# EAGLE schematic load_cell_amp_JA (EAGLE 9.5.2)
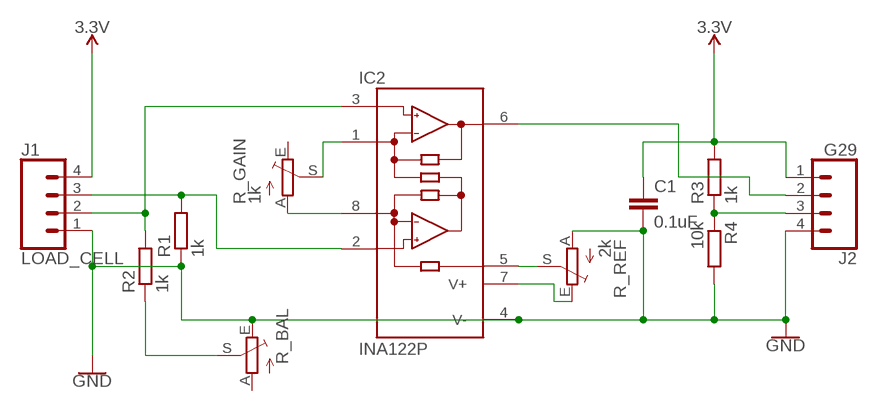
[diagram p0: schematic, sheet 1]

## Parts
C1  0.1uF  C-EU025-024X044  [C025-024X044]
IC2  INA122P  [DIL08]
J1  LOAD_CELL  M04  [04P]
J2  G29  M04  [04P]
R1  1k  R-EU_0207/10  [0207/10]
R2  1k  R-EU_0207/10  [0207/10]
R3  1k  R-EU_0207/10  [0207/10]
R4  10k  R-EU_0207/10  [0207/10]
R_BAL  10  TRIM_EU-RJ9W  [RJ9W]
R_GAIN  1k  TRIM_EU-RJ9W  [RJ9W]
R_REF  2k  TRIM_EU-RJ9W  [RJ9W]

## Nets
3.3V: C1.1 J1.4 J2.1 R3.2
GND: C1.2 IC2.4(V-) J1.1 J2.4 R1.1 R4.2 R_BAL.E R_REF.A
N$1: IC2.2(-IN) J1.3 R1.2
N$2: IC2.3(+IN) J1.2 R2.2
N$3: R2.1 R_BAL.S
N$4: IC2.1(RG) R_GAIN.S
N$5: IC2.8(RG) R_GAIN.A
N$6: J2.3 R3.1 R4.1
N$7: IC2.6(OUT) J2.2
N$8: IC2.7(V+) R_REF.E
N$9: IC2.5(REF) R_REF.S
Unconnected: R_BAL.A R_GAIN.E

## Library data of the parts
C1 = rcl:C-EU: CAPACITOR, European symbol; SPICEPREFIX: C
IC2 = burr-brown:INA122: Instrumentation Amplifier Single Supply, MicroPower; MF: TEXAS INSTRUMENTS; MPN: INA122P; OC_FARNELL: 1459460; OC_NEWARK: 15M0948
J1 J2 = con-amp-quick:M04: AMP QUICK CONNECTOR; OC_FARNELL: unknown; OC_NEWARK: unknown
R1-R4 = rcl:R-EU_: RESISTOR, European symbol; SPICEPREFIX: R
R_BAL R_GAIN R_REF = pot:TRIM_EU-: POTENTIOMETER